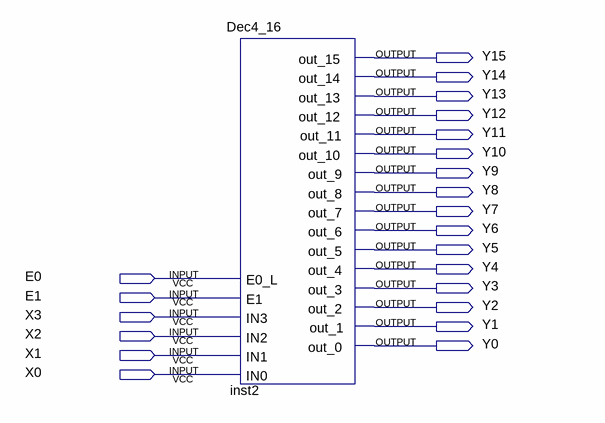
[diagram p0: schematic sheet]
// Quartus schematic DecoderDemo4_16.bdf as structural Verilog: 1 symbols, 22 pins
module DecoderDemo4_16 (
  input  E0,
  input  E1,
  input  X3,
  input  X2,
  input  X1,
  input  X0,
  output Y15,
  output Y14,
  output Y13,
  output Y12,
  output Y11,
  output Y10,
  output Y9,
  output Y8,
  output Y7,
  output Y6,
  output Y5,
  output Y4,
  output Y3,
  output Y2,
  output Y1,
  output Y0
);

  Dec4_16 inst2 (
    .IN0(X0), .IN1(X1), .IN2(X2), .IN3(X3), .E1(E1), .E0_L(E0), .out_15(Y15), .out_14(Y14), .out_13(Y13),
    .out_12(Y12), .out_11(Y11), .out_10(Y10), .out_9(Y9), .out_8(Y8), .out_7(Y7), .out_6(Y6), .out_5(Y5),
    .out_4(Y4), .out_3(Y3), .out_2(Y2), .out_1(Y1), .out_0(Y0));
endmodule
